# EAGLE design ATR PDB Draft Rev4 (EAGLE 9.6.2)

## Sheet 1 of 3
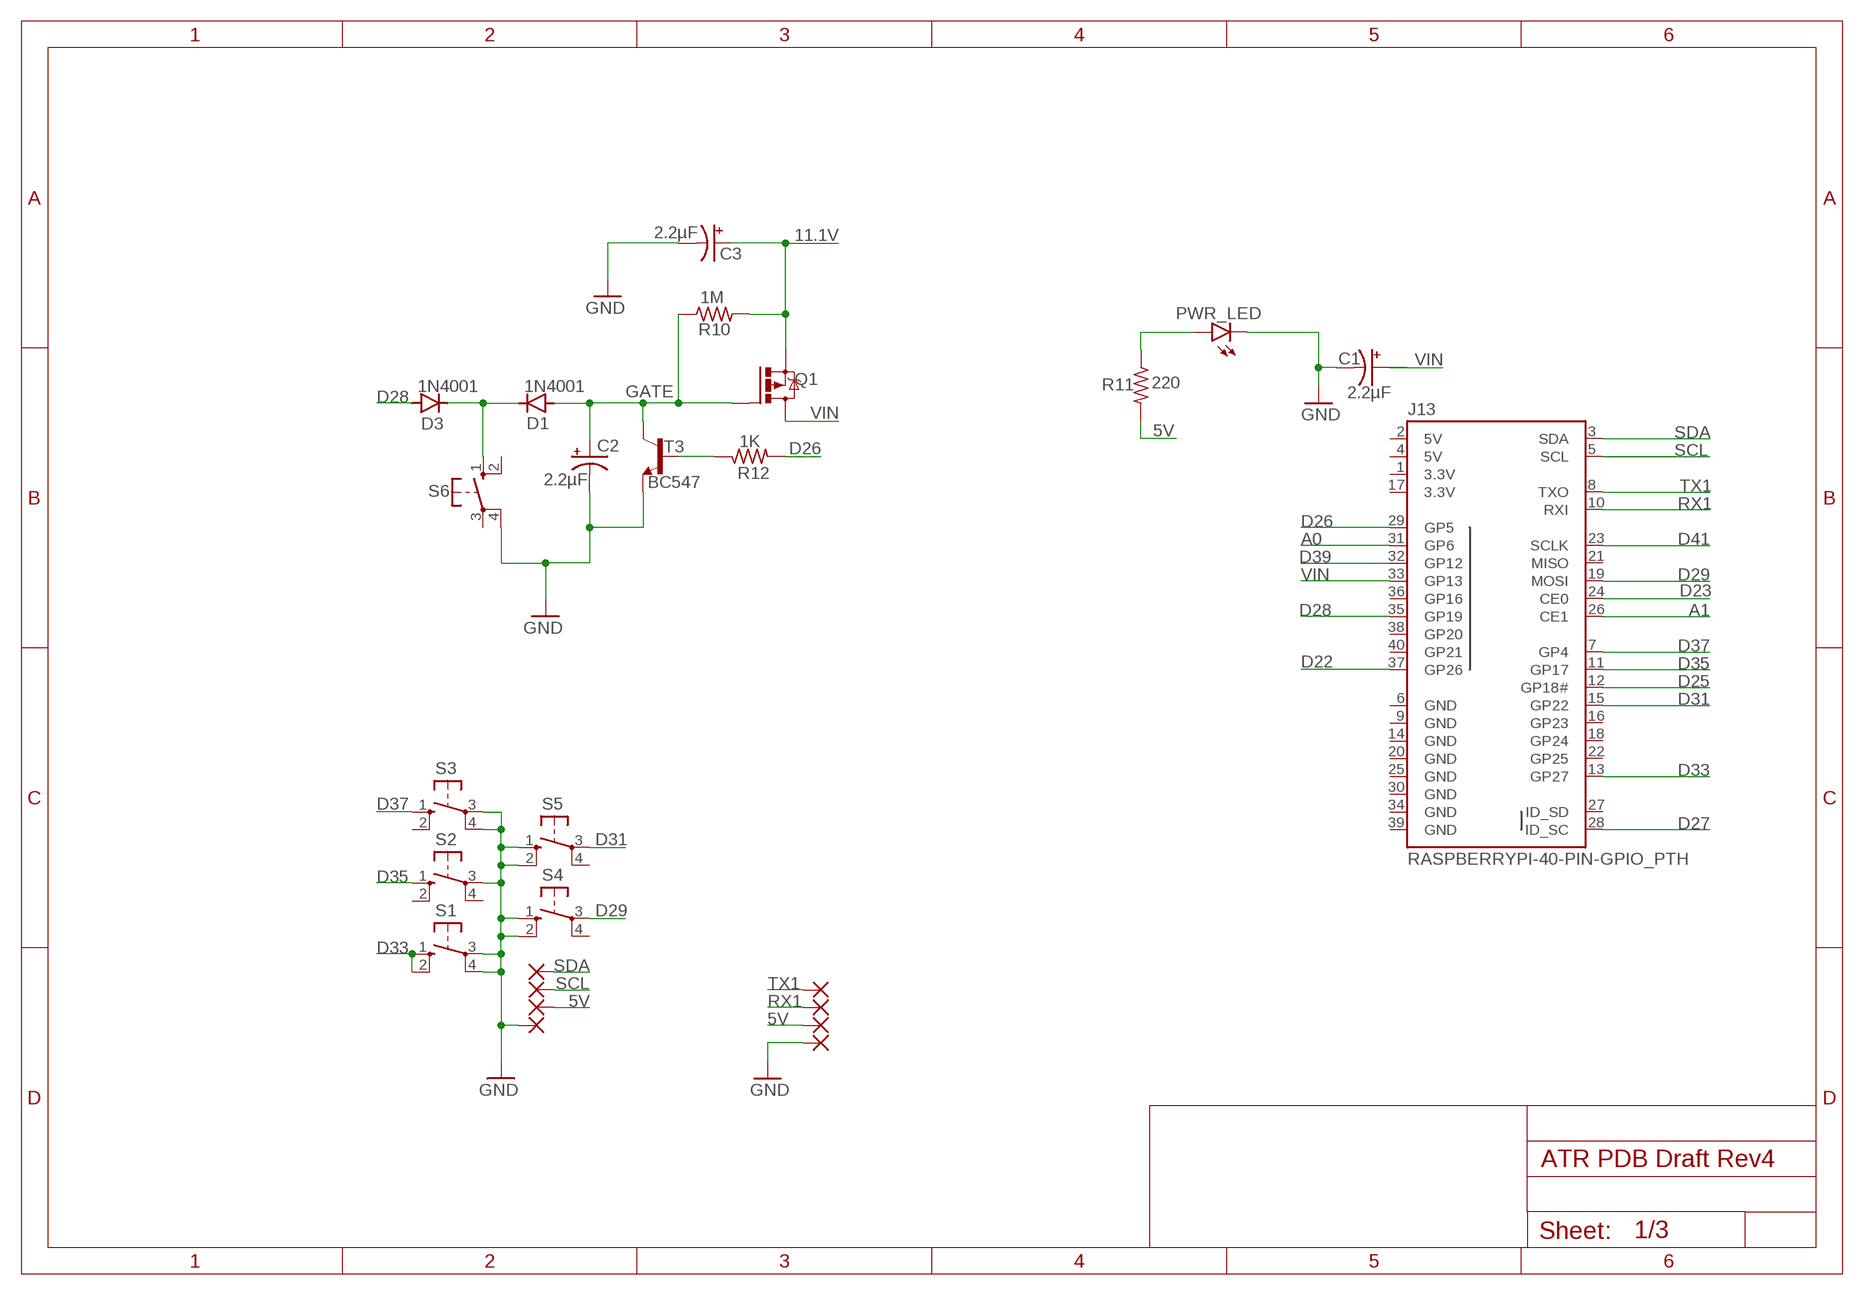
[diagram p0: schematic, sheet 1]

### Parts
C1  2.2µF  CPOL-USTT2D5  [TT2D5]
C2  2.2µF  CPOL-USTT2D5  [TT2D5]
C3  2.2µF  CPOL-USTT2D5  [TT2D5]
D1  1N4004  [DO41-10]
D3  1N4004  [DO41-10]
J13  RASPBERRYPI-40-PIN-GPIO_PTH  [2X20_SHROUDED]
PAD1  1,6/0,8  [1,6/0,8]
PAD2  1,6/0,8  [1,6/0,8]
PAD3  1,6/0,8  [1,6/0,8]
PAD4  1,6/0,8  [1,6/0,8]
PAD5  1,6/0,8  [1,6/0,8]
PAD6  1,6/0,8  [1,6/0,8]
PAD7  1,6/0,8  [1,6/0,8]
PAD8  1,6/0,8  [1,6/0,8]
PWR_LED  LED3MM  [LED3MM]
Q1  IRF9530  [TO220BV]
R10  1M  R-US_0207/10  [0207/10]
R11  220  R-US_0204/7  [0204/7]
R12  1K  R-US_0204/7  [0204/7]
S1  10-XX  [B3F-10XX]
S2  10-XX  [B3F-10XX]
S3  10-XX  [B3F-10XX]
S4  10-XX  [B3F-10XX]
S5  10-XX  [B3F-10XX]
S6  10-XX  [B3F-10XX]
T3  BC547  [TO92]

### Nets
5V: PAD1.1(P) PAD7.1(P) R11.2
11.1V: C3.+ Q1.S R10.2 ; also sheet 2
A0: J13.31(GP6) ; also sheet 2
A1: J13.26(CE1) ; also sheet 3
D22: J13.37(GP26) ; also sheet 2
D23: J13.24(CE0) ; also sheet 3
D25: J13.12(GP18#) ; also sheet 3
D26: J13.29(GP5) R12.2
D27: J13.28(ID_SC) ; also sheet 3
D28: D3.A J13.35(GP19)
D29: J13.19(MOSI) S4.3(P)
D31: J13.15(GP22) S5.3(P)
D33: J13.13(GP27) S1.1(S) S1.2(S1)
D35: J13.11(GP17) S2.1(S)
D37: J13.7(GP4) S3.1(S)
D39: J13.32(GP12) ; also sheet 2
D41: J13.23(SCLK) ; also sheet 2
GATE: C2.+ D1.A Q1.G R10.1 T3.3(C)
GND: C1.- C2.- C3.- PAD3.1(P) PAD8.1(P) PWR_LED.K(C) S1.3(P) S1.4(P1) S2.3(P) S3.3(P) S3.4(P1) S4.1(S) S4.2(S1) S5.1(S) S5.2(S1) S6.4(P1) T3.1(E) ; also sheet 2,3
N$8: PWR_LED.A R11.1
N$11: D1.C D3.C S6.1(S)
RX1: J13.10(RXI) PAD2.1(P)
SCL: J13.5(SCL) PAD6.1(P)
SDA: J13.3(SDA) PAD5.1(P)
T3-B: R12.1 T3.2(B)
TX1: J13.8(TXO) PAD4.1(P)
VIN: C1.+ J13.33(GP13) Q1.D
Unconnected: J13.16(GP23) J13.18(GP24) J13.21(MISO) J13.22(GP25) J13.27(ID_SD) J13.36(GP16) J13.38(GP20) J13.40(GP21) S2.2(S1) S2.4(P1) S3.2(S1) S4.4(P1) S5.4(P1) S6.2(S1) S6.3(P)

### Notes on the sheet
- Arduino Power Switching | Arduino Mega Connections
- OLED Connection & Control
- 3DR Radio Connection
- Aruino Mega Connections

## Sheet 2 of 3
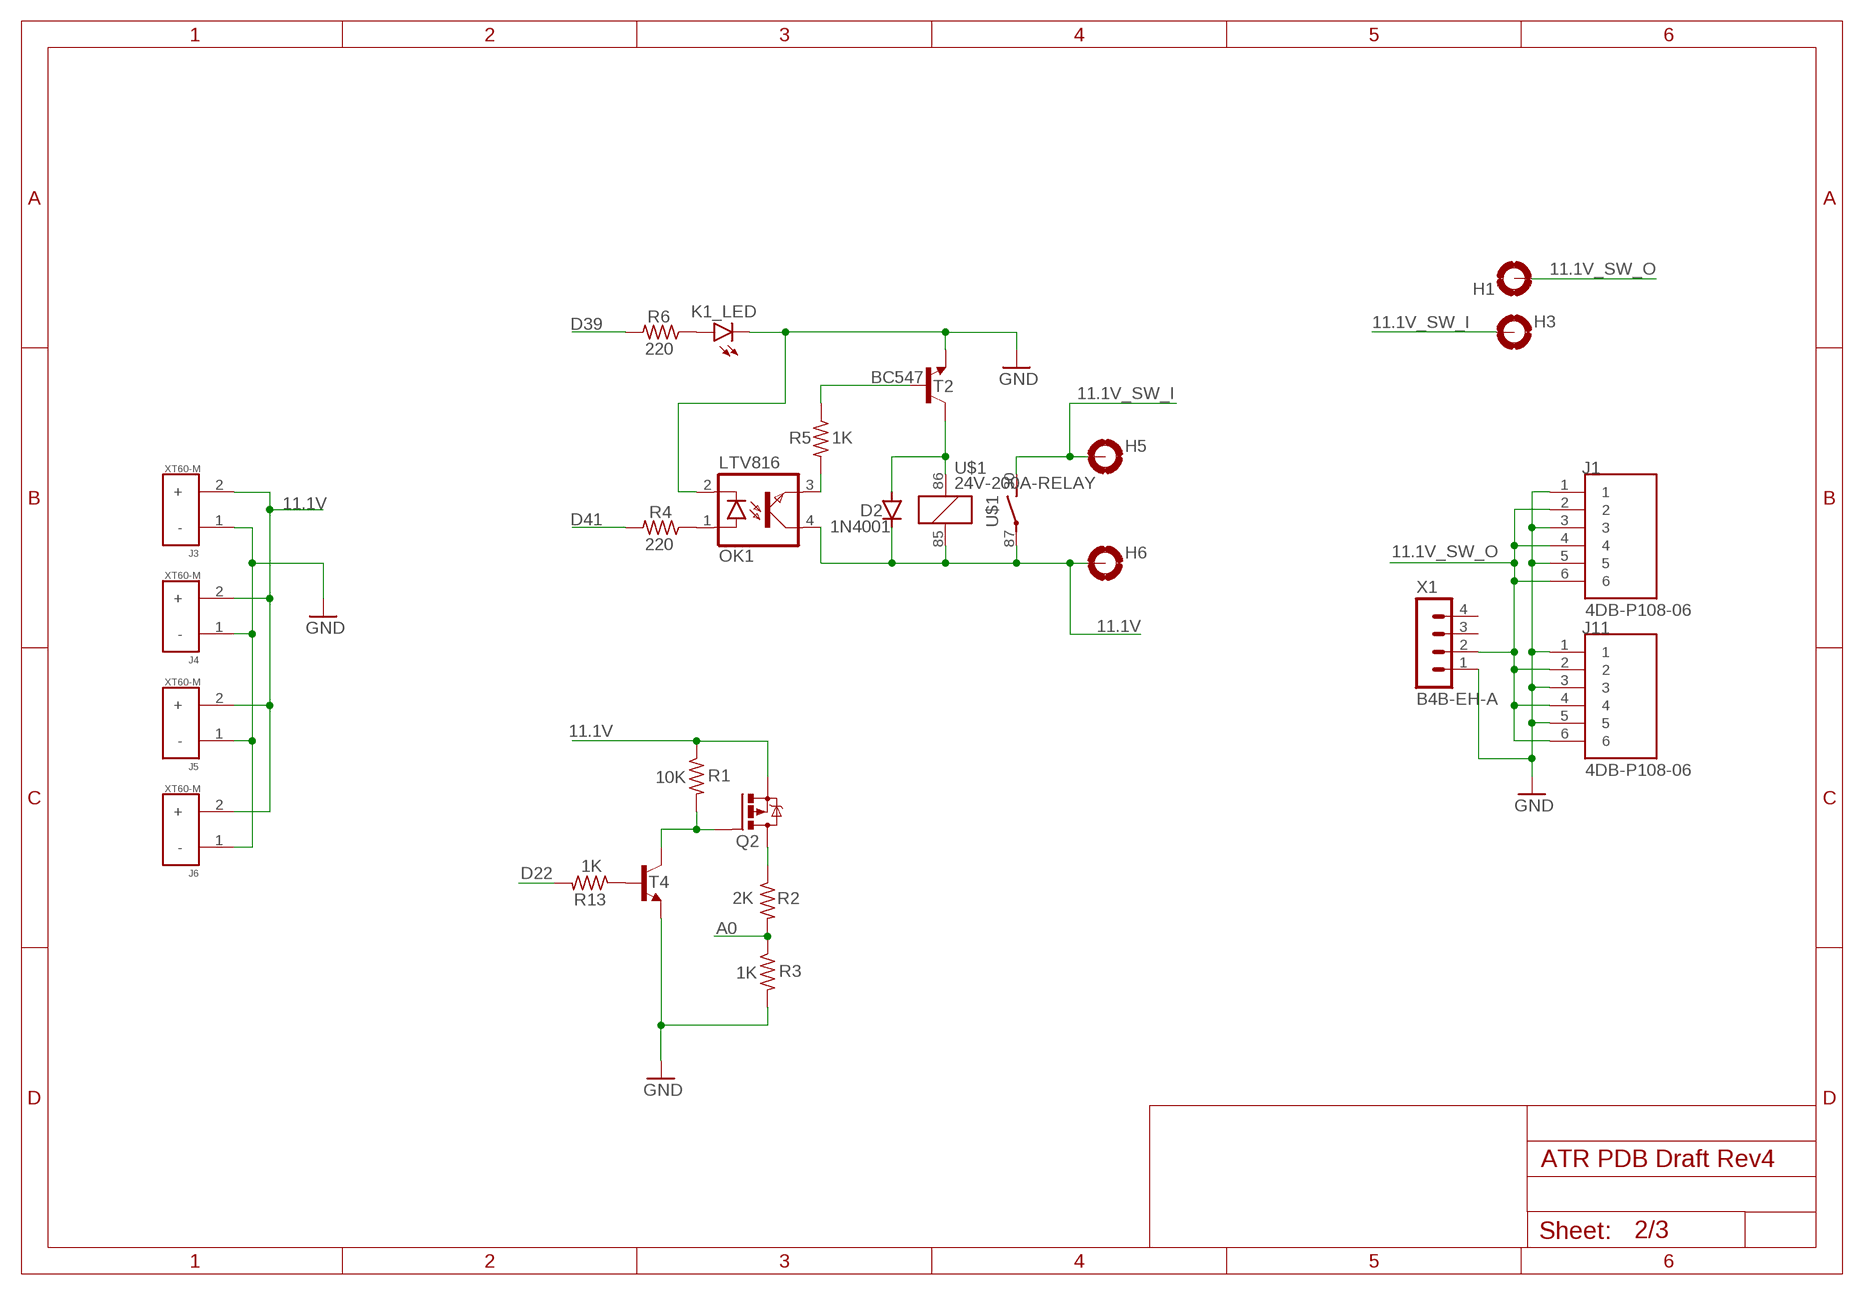
[diagram p1: schematic, sheet 2]

### Parts
D2  1N4004  [DO41-10]
H1  MOUNT-PAD-ROUND3.0  [3,0-PAD]
H3  MOUNT-PAD-ROUND3.0  [3,0-PAD]
H5  MOUNT-PAD-ROUND3.0  [3,0-PAD]
H6  MOUNT-PAD-ROUND3.0  [3,0-PAD]
J1  4DB-P108-06  [TE_2-1437667-9]
J3  XT60-M  [AMASS_XT60-M]
J4  XT60-M  [AMASS_XT60-M]
J5  XT60-M  [AMASS_XT60-M]
J6  XT60-M  [AMASS_XT60-M]
J11  4DB-P108-06  [TE_2-1437667-9]
K1_LED  LED3MM  [LED3MM]
OK1  LTV816  [DIL04]
Q2  IRF9530  [TO220BV]
R1  10K  R-US_0204/7  [0204/7]
R2  2K  R-US_0204/7  [0204/7]
R3  1K  R-US_0204/7  [0204/7]
R4  220  R-US_0204/7  [0204/7]
R5  1K  R-US_0204/7  [0204/7]
R6  220  R-US_0204/7  [0204/7]
R13  1K  R-US_0204/7  [0204/7]
T2  BC547  [TO92]
T4  BC547  [TO92]
U$1  24V-200A-RELAY  [24V-200A-RELAY]
X1  B4B-EH-A  [B4B-EH-A]

### Nets
11.1V: D2.C H6.B3,0(MOUNT) J3.2(+) J4.2(+) J5.2(+) J6.2(+) OK1.4(COL) Q2.S R1.1 U$1.85 U$1.87 ; also sheet 1
11.1V_SW_I: H3.B3,0(MOUNT) H5.B3,0(MOUNT) U$1.30
11.1V_SW_O: H1.B3,0(MOUNT) J1.2 J1.4 J1.6 J11.2 J11.4 J11.6 X1.2
A0: R2.2 R3.1 ; also sheet 1
D22: R13.2 ; also sheet 1
D39: R6.2 ; also sheet 1
D41: R4.2 ; also sheet 1
DRAIN1: Q2.D R2.1
GATE1: Q2.G R1.2 T4.3(C)
GND: J1.1 J1.3 J1.5 J3.1(-) J4.1(-) J5.1(-) J6.1(-) J11.1 J11.3 J11.5 K1_LED.K(C) OK1.2(C) R3.2 T2.1(E) T4.1(E) X1.1 ; also sheet 1,3
N$1: OK1.1(A) R4.1
N$2: K1_LED.A R6.1
N$9: R13.1 T4.2(B)
N$14: OK1.3(EMIT) R5.2
N$15: R5.1 T2.2(B)
N$16: D2.A T2.3(C) U$1.86
Unconnected: X1.3 X1.4

### Notes on the sheet
- 11.1V CUT OFF SWITCH CONNECTION
- 11.1V Relay Control
- 11.1V OUTPUTS
- 11.1V INPUTS
- 11.1V Monitoring
- 11.1V CONNECTIONS,
  MONITORING, AND 
  RELAY CONTROL

## Sheet 3 of 3
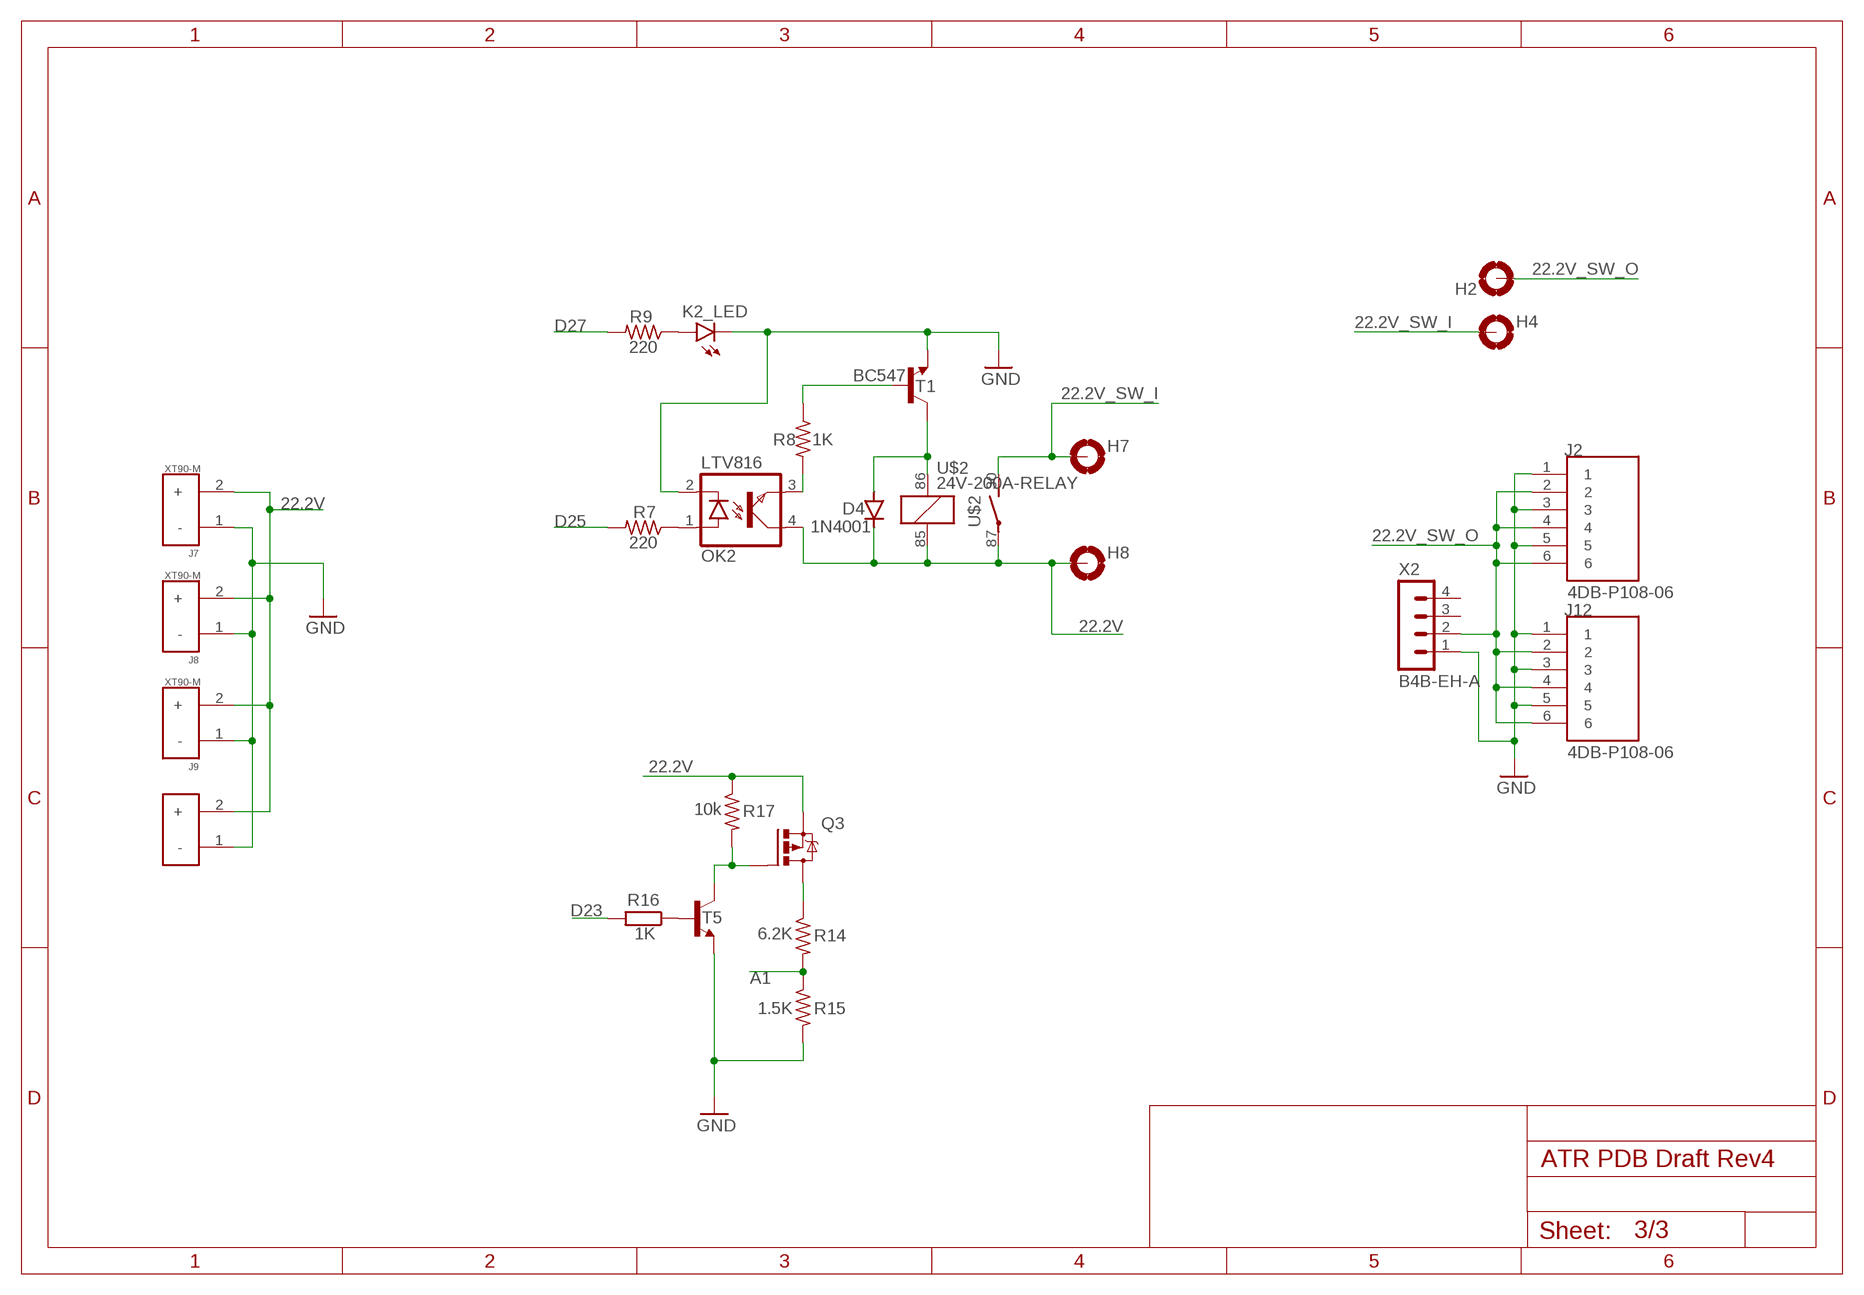
[diagram p2: schematic, sheet 3]

### Parts
D4  1N4004  [DO41-10]
H2  MOUNT-PAD-ROUND3.0  [3,0-PAD]
H4  MOUNT-PAD-ROUND3.0  [3,0-PAD]
H7  MOUNT-PAD-ROUND3.0  [3,0-PAD]
H8  MOUNT-PAD-ROUND3.0  [3,0-PAD]
J2  4DB-P108-06  [TE_2-1437667-9]
J7  XT90-M  [AMASS_XT90-M]
J8  XT90-M  [AMASS_XT90-M]
J9  XT90-M  [AMASS_XT90-M]
J10  XT90-M  [AMASS_XT90-M]
J12  4DB-P108-06  [TE_2-1437667-9]
K2_LED  LED3MM  [LED3MM]
OK2  LTV816  [DIL04]
Q3  IRF9530  [TO220BV]
R7  220  R-US_0204/7  [0204/7]
R8  1K  R-US_0204/7  [0204/7]
R9  220  R-US_0204/7  [0204/7]
R14  6.2K  R-US_0204/7  [0204/7]
R15  1.5K  R-US_0207/10  [0207/10]
R16  1K  R-EU_0204/7  [0204/7]
R17  10k  R-US_0204/7  [0204/7]
T1  BC547  [TO92]
T5  BC547  [TO92]
U$2  24V-200A-RELAY  [24V-200A-RELAY]
X2  B4B-EH-A  [B4B-EH-A]

### Nets
22.2V: D4.C H8.B3,0(MOUNT) J7.2(+) J8.2(+) J9.2(+) J10.2(+) OK2.4(COL) Q3.S R17.1 U$2.85 U$2.87
22.2V_SW_I: H4.B3,0(MOUNT) H7.B3,0(MOUNT) U$2.30
22.2V_SW_O: H2.B3,0(MOUNT) J2.2 J2.4 J2.6 J12.2 J12.4 J12.6 X2.2
A1: R14.2 R15.1 ; also sheet 1
D23: R16.2 ; also sheet 1
D25: R7.2 ; also sheet 1
D27: R9.2 ; also sheet 1
DRAIN2: Q3.D R14.1
GATE2: Q3.G R17.2 T5.3(C)
GND: J2.1 J2.3 J2.5 J7.1(-) J8.1(-) J9.1(-) J10.1(-) J12.1 J12.3 J12.5 K2_LED.K(C) OK2.2(C) R15.2 T1.1(E) T5.1(E) X2.1 ; also sheet 1,2
N$4: OK2.3(EMIT) R8.2
N$5: R8.1 T1.2(B)
N$7: D4.A T1.3(C) U$2.86
N$12: OK2.1(A) R7.1
N$13: K2_LED.A R9.1
N$18: R16.1 T5.2(B)
Unconnected: X2.3 X2.4

### Notes on the sheet
- 22.2V CUT OFF SWITCH CONNECTION
- 22.2V RELAY CONTROL
- 22.2V OUTPUTS
- 22.2V INPUTS
- 22.2V MONITORING
- 22.2V CONNECTIONS,
  MONITORING, AND
  RELAY CONTROL

## Power pins joined to a net without a drawn wire
3.3V: J13.1(3.3V) J13.17(3.3V)
5V: J13.2(5V) J13.4(5V)
GND: J13.6(GND) J13.9(GND) J13.14(GND) J13.20(GND) J13.25(GND) J13.30(GND) J13.34(GND) J13.39(GND)

## Library data of the parts
C1-C3 = rcl:CPOL-US: POLARIZED CAPACITOR, American symbol; SPICEPREFIX: C
D1-D4 = diode:1N4004: DIODE general purpose rectifier, 1 A
H1-H8 = holes:MOUNT-PAD-ROUND: MOUNTING PAD, round
J1 J2 J11 J12 = 4DB-P108-06:4DB-P108-06: Check prices <https://pricing.snapeda.com/parts/4DB-P108-06/TE%20Connectivity/view-part?ref=eda>; AVAILABILITY: Good; COMMENT: 2-1437667-9; DESCRIPTION: 6 Circuit 0.325 (8.26mm) Barrier Block Connector, Screws with Captive Plate; MF: TE Connectivity; MP: 4DB-P108-06; PACKAGE: None; PRICE: None; PURCHASE-URL: https://pricing.snapeda.com/search/part/4DB-P108-06/?ref=eda
J3-J6 = XT60-M:XT60-M: DC supply; XT60; male; PIN:2; for cable; soldered; 60A; 500V; AVAILABILITY: Unavailable; DESCRIPTION: Plug; DC supply; XT60; male; PIN: 2; for cable; soldered; 30A; 500V; MF: AMASS; MP: XT60-M; PACKAGE: Package; PRICE: None
J7-J10 = XT90-M:XT90-M: DC supply; XT60; male; PIN:2; for cable; soldered; 60A; 500V; AVAILABILITY: Unavailable; DESCRIPTION: Plug; DC supply; XT60; male; PIN: 2; for cable; soldered; 30A; 500V; MF: AMASS; MP: XT60-M; PACKAGE: Package; PRICE: None
J13 = SparkFun-Connectors:RASPBERRYPI-40-PIN-GPIO: Raspberry Pi GPIO Header 2x20 pin connector, as found on B, B+, A+ models. Both shrouded PTH and SMT versions available. SparkFun Products: GPIO Shrouded Header <https://www.sparkfun.com/products/13054>- PTH SparkFun Pi Wedge (Preassembled) <https://www.sparkfun.com/products/13717>; PROD_ID: CONN-12263; SF_ID: PRT-13054
K1_LED K2_LED PWR_LED = led:LED: LED OSRAM: - CHIPLED LG R971, LG N971, LY N971, LG Q971, LY Q971, LO R971, LY R971 LH N974, LH R974 LS Q976, LO Q976, LY Q976 LO Q996 - Hyper CHIPLED LW Q18S LB Q993, LB Q99A, LB R99A - SideLED LS A670, LO A670, LY A670, LG A670, LP A670 LB A673, LV A673, LT A673, LW A673 LH A674 LY A675 LS A676, LA A676, LO A676, LY A676, LW A676 LS A679, LY A679, LG A679 - Hyper Micro SIDELED® LS Y876, LA Y876, LO Y876, LY Y876 LT Y87S - SmartLED LW L88C, LW L88S LB L89C, LB L89S, LG L890 LS L89K, LO L89K, LY L89K LS L896, LA L896, LO L896, LY L896 - TOPLED LS T670, LO T670, LY T670, LG T670, LP T670 LSG T670, LSP T670, LSY T670, LOP T670, LYG T670 LG T671, LOG T671, LSG T671 LB T673, LV T673, LT T673, LW T673 LH T674 LS T676, LA T676, LO T676, LY T676, LB T676, LH T676, LSB T676, LW T676 LB T67C, LV T67C, LT T67C, LS T67K, LO T67K, LY T67K, LW E67C LS E67B, LA E67B, LO E67B, LY E67B, LB E67C, LV E67C, LT E67C LW T67C LS T679, LY T679, LG T679 LS T770, LO T770, LY T770, LG T770, LP T770 LB T773, LV T773, LT T773, LW T773 LH T774 LS E675, LA E675, LY E675, LS T675 LS T776, LA T776, LO T776, LY T776, LB T776 LHGB T686 LT T68C, LB T68C - Hyper Mini TOPLED® LB M676 - Mini TOPLED Santana® LG M470 LS M47K, LO M47K, LY M47K Source: http://www.osram.convergy.de LUXEON: - LUMILED® LXK2-PW12-R00, LXK2-PW12-S00, LXK2-PW14-U00, LXK2-PW14-V00 LXK2-PM12-R00, LXK2-PM12-S00, LXK2-PM14-U00 LXK2-PE12-Q00, LXK2-PE12-R00, LXK2-PE12-S00, LXK2-PE14-T00, LXK2-PE14-U00 LXK2-PB12-K00, LXK2-PB12-L00, LXK2-PB12-M00, LXK2-PB14-N00, LXK2-PB14-P00, LXK2-PB14-Q00 LXK2-PR12-L00, LXK2-PR12-M00, LXK2-PR14-Q00, LXK2-PR14-R00 LXK2-PD12-Q00, LXK2-PD12-R00, LXK2-PD12-S00 LXK2-PH12-R00, LXK2-PH12-S00 LXK2-PL12-P00, LXK2-PL12-Q00, LXK2-PL12-R00 Source: www.luxeon.com KINGBRIGHT: KA-3528ASYC Source: www.kingbright.com
OK1 OK2 = optocoupler:LTV816: OPTO COUPLER Source: LITEON, LTV816.pdf; OC_FARNELL: unknown; OC_NEWARK: unknown
PAD1-PAD8 = wirepad:1,6/0,8: THROUGH-HOLE PAD
Q1-Q3 = transistor-power:IRF9530: P-CHANNEL HEXFET POWER-MOS-FET Source: http://www.irf.com/product-info/datasheets/data/irf9530.pdf
R1-R15 R17 = rcl:R-US_: RESISTOR, American symbol; SPICEPREFIX: R
R16 = rcl:R-EU_: RESISTOR, European symbol; SPICEPREFIX: R
S1-S6 = switch-omron:10-XX: OMRON SWITCH; MPN: B3F-1000; OC_FARNELL: 176432; OC_NEWARK: 36M3542
T1-T5 = transistor:BC547: NPN TRANSISTOR
U$1 U$2 = 24V-200A-RELAY:24V-200A-RELAY
X1 X2 = con-JST EH:B4B-EH: JST EH series header 2.50mm pitch disconnectable crimp style connectors, vertical (side entry type), 4 pins

## Board
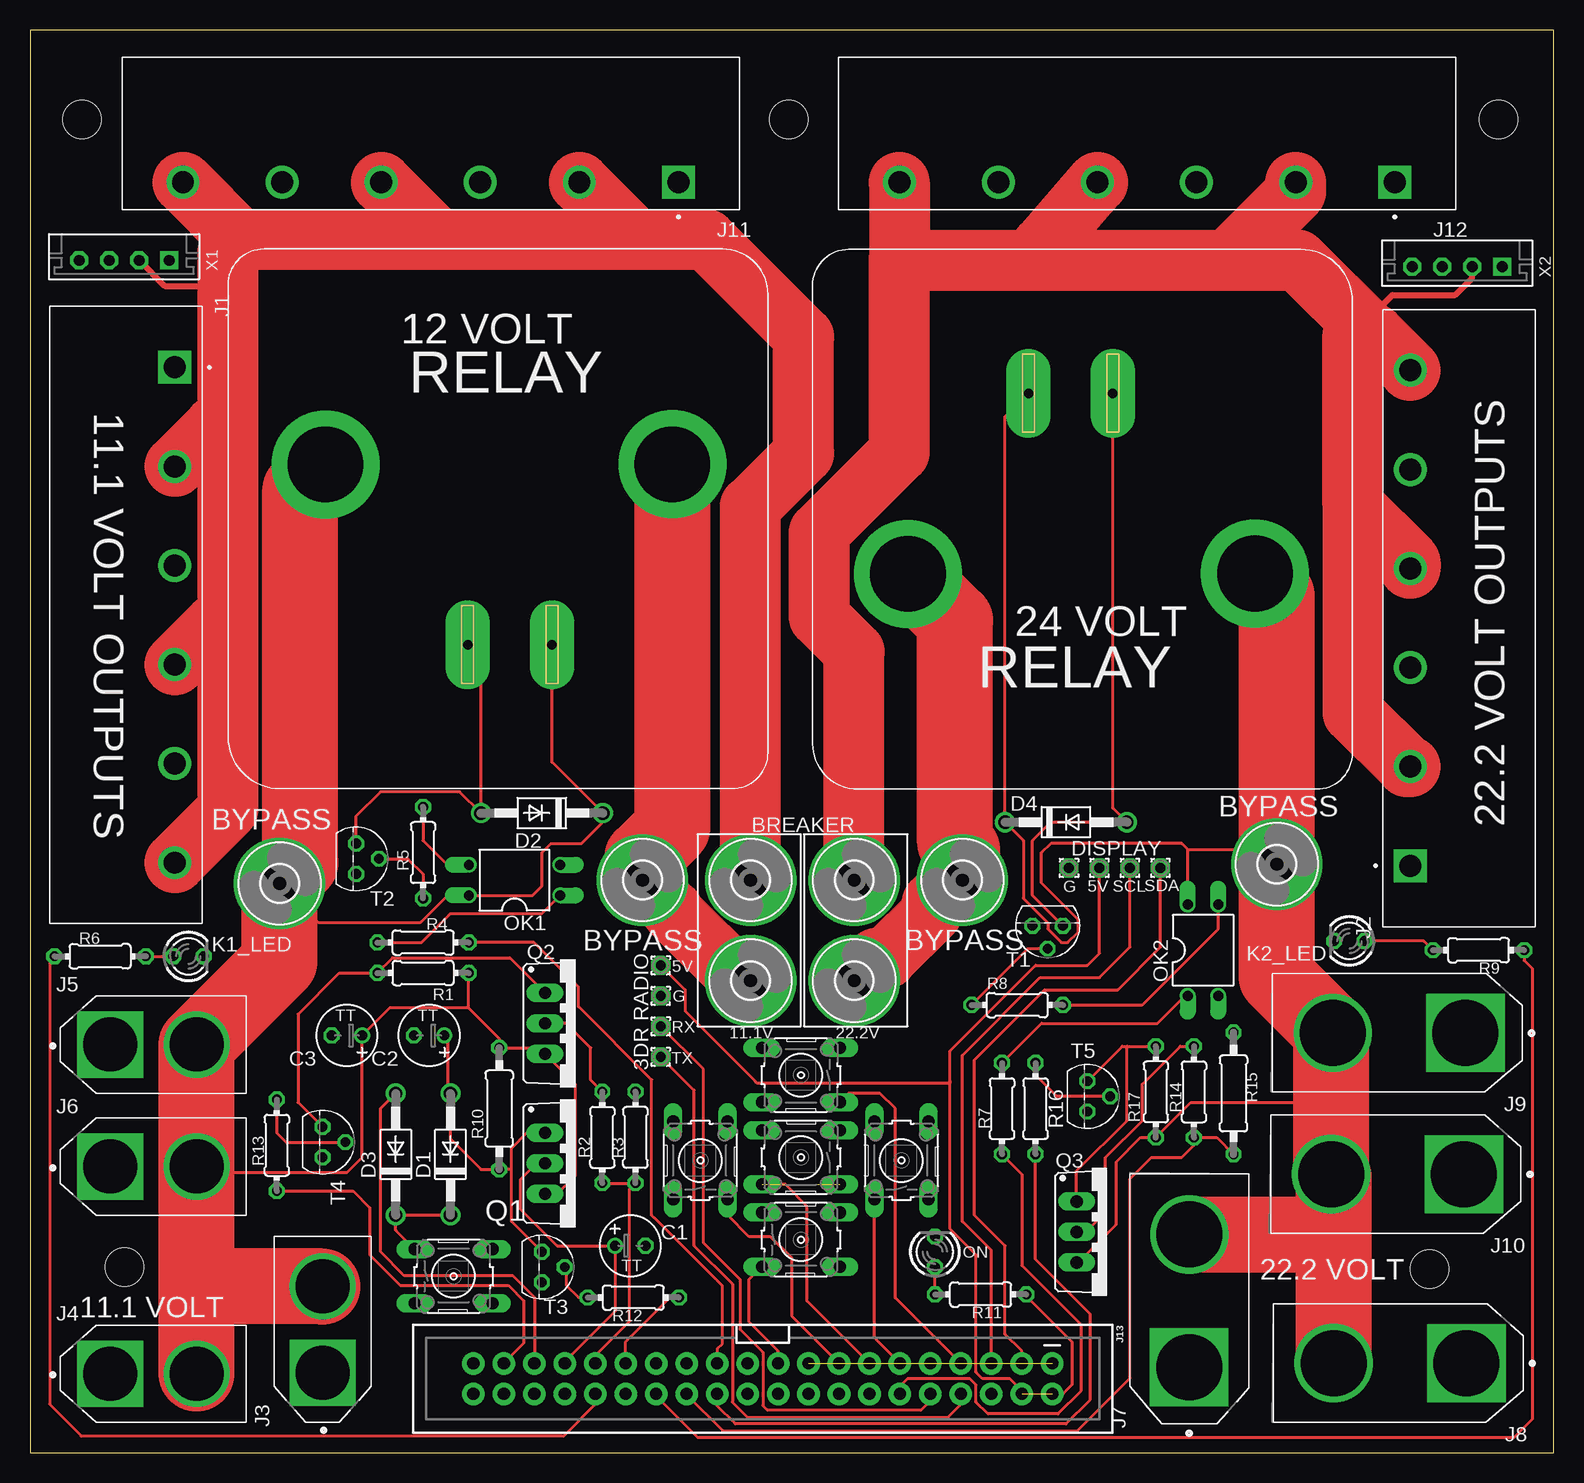
[diagram p3: board, top side]
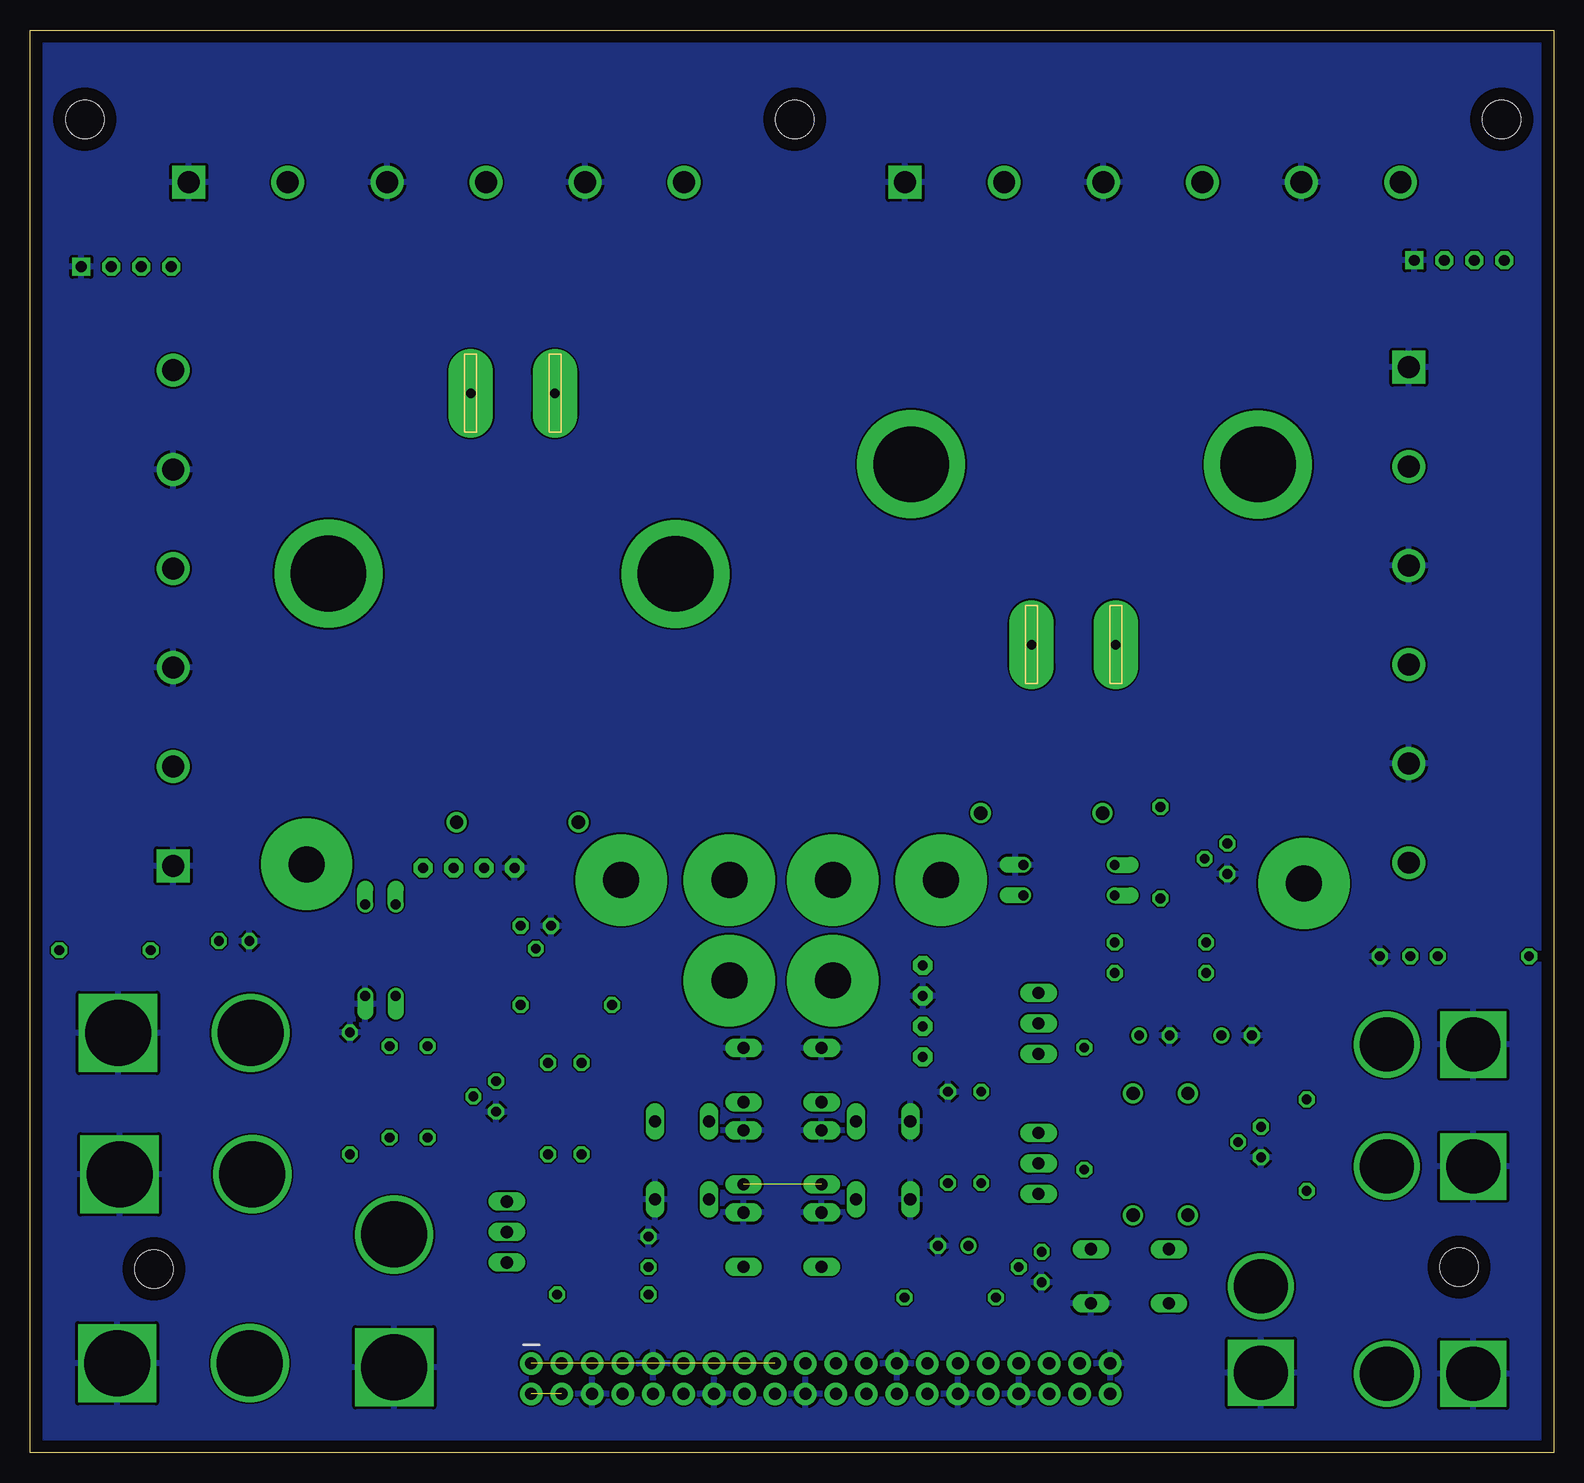
[diagram p4: board, bottom side, seen from below]

Size 127 x 118.62 mm. Coordinates in mm from the lower left corner, seen from the top.
Outline: 0,0 127,0 127,118.62 0,118.62 0,0
Copper layers (1*16): Top 0.035mm / dielectric 1.5mm / Bottom 0.035mm
Design rules "default": minimum track width 6mil, minimum drill 0.35mm, track to track 6mil, track to pad 6mil, pad to pad 6mil, via to via 6mil, smd to smd 6mil, copper to edge 40mil, drill to drill 6mil, minimum pad ring 10mil, minimum via ring 8mil, stop-mask expansion 4mil, vias tented up to drill 0mil, thermal gap 10mil
Holes 3.2 mm at 7.87,15.49 116.66,15.34 63.25,111.18 4.32,111.18 122.43,111.18

### Footprints (pad centres in the part's own frame; a part is rotated, then mirrored left to right if it is on the bottom)
TT2D5 = drill 0.813: + -1.27,0 | drill 0.813 octagon: - 1.27,0
DO41-10 = drill 1.118: A 5.08,0; C -5.08,0
3,0-PAD = drill 3 pad 7.62: B3,0 0,0
TE_2-1437667-9 = drill 1.83 square: 1 -20.65,0 | drill 1.83: 2 -12.39,0; 3 -4.13,0; 4 4.13,0; 5 12.39,0; 6 20.65,0
AMASS_XT60-M = drill 4.5 square: 1 -3.6,0 | drill 4.5: 2 3.6,0
AMASS_XT90-M = drill 5.5 square: 1 -3.029,0.905 | drill 5.5: 2 8.045,0.889
2X20_SHROUDED = drill 1.016 pad 1.88: 1 -1.27,24.13; 2 1.27,24.13; 3 -1.27,21.59; 4 1.27,21.59; 5 -1.27,19.05; 6 1.27,19.05; 7 -1.27,16.51; 8 1.27,16.51; 9 -1.27,13.97; 10 1.27,13.97; 11 -1.27,11.43; 12 1.27,11.43; 13 -1.27,8.89; 14 1.27,8.89; 15 -1.27,6.35; 16 1.27,6.35; 17 -1.27,3.81; 18 1.27,3.81; 19 -1.27,1.27; 20 1.27,1.27; 21 -1.27,-1.27; 22 1.27,-1.27; 23 -1.27,-3.81; 24 1.27,-3.81; 25 -1.27,-6.35; 26 1.27,-6.35; 27 -1.27,-8.89; 28 1.27,-8.89; 29 -1.27,-11.43; 30 1.27,-11.43; 31 -1.27,-13.97; 32 1.27,-13.97; 33 -1.27,-16.51; 34 1.27,-16.51; 35 -1.27,-19.05; 36 1.27,-19.05; 37 -1.27,-21.59; 38 1.27,-21.59; 39 -1.27,-24.13; 40 1.27,-24.13
LED3MM = drill 0.813 octagon: A -1.27,0; K 1.27,0
DIL04 = drill 0.813 offset: 1 -1.27,-3.81; 2 1.27,-3.81; 3 1.27,3.81; 4 -1.27,3.81
1,6/0,8 = drill 0.813 pad 1.6 octagon: 1 0,0
TO220BV = drill 1.016 long: D 0,-2.54; G -2.54,-2.54; S 2.54,-2.54
0204/7 = drill 0.813 octagon: 1 -3.81,0; 2 3.81,0
0207/10 = drill 0.813 octagon: 1 -5.08,0; 2 5.08,0
B3F-10XX = drill 1.016 long: 1 -3.251,2.261; 2 3.251,2.261; 3 -3.251,-2.261; 4 3.251,-2.261
TO92 = drill 0.813 octagon: 1 1.27,0; 2 0,1.905; 3 -1.27,0
24V-200A-RELAY = drill 6.3 pad 9: 30 37.045,27.054; 87 8.127,27.021 | drill 0.8 pad 3.7 long: 85 26.999,12.004; 86 19.975,12.003
B4B-EH-A = drill 0.9 pad 1.5 square: 1 -3.75,0 | drill 0.9 pad 1.5 octagon: 2 -1.25,0; 3 1.25,0; 4 3.75,0

### Placement (x,y rotation side)
C1  50.04,17.27 0 top
C2  33.27,34.8 180 top
C3  26.42,34.8 180 top
D1  35.05,24.89 90 top
D2  42.67,53.34 180 top
D3  30.48,24.89 90 top
D4  86.36,52.58 0 top
H1  60.07,47.75 0 top
H2  68.71,47.75 0 top
H3  60.07,39.37 0 top
H4  68.71,39.37 0 top
H5  51.05,47.75 180 top
H6  20.8,47.47 180 top
H7  77.72,47.75 0 top
H8  103.94,49.07 0 top
J1  12.06,69.85 270 top
J2  115.06,69.6 90 top
J3  24.38,10.29 90 top
J4  10.29,6.6 0 top
J5  10.29,34.04 0 top
J6  10.29,23.88 0 top
J7  97.54,10.16 90 top
J8  116.71,8.38 180 top
J9  116.64,35.92 180 top
J10  116.51,24.13 180 top
J11  33.4,105.92 180 top
J12  93.12,105.92 180 top
J13  61.09,6.2 270 top
K1_LED  13.21,41.4 0 top
K2_LED  109.98,42.67 180 top
OK1  40.39,47.75 90 top
OK2  97.79,41.91 0 top
PAD1  52.58,40.64 270 top
PAD2  52.58,35.56 270 top
PAD3  52.58,38.1 270 top
PAD4  52.58,33.02 270 top
PAD5  94.23,48.77 0 top
PAD6  91.69,48.77 0 top
PAD7  89.15,48.77 0 top
PAD8  86.61,48.77 0 top
PWR_LED  75.44,16.76 90 top
Q1  45.47,24.13 270 top
Q2  45.47,35.81 270 top
Q3  89.79,18.41 270 top
R1  32.77,40.01 180 top
R2  47.71,26.3 270 top
R3  50.47,26.3 90 top
R4  32.77,42.55 0 top
R5  32.77,50.04 90 top
R6  5.84,41.4 180 top
R7  81.03,28.7 270 top
R8  82.3,37.34 0 top
R9  120.75,41.91 0 top
R10  39.12,28.7 90 top
R11  79.25,13.21 0 top
R12  50.29,12.95 0 top
R13  20.57,25.65 270 top
R14  97.03,30.1 270 top
R15  100.33,29.97 90 top
R16  83.82,28.7 270 top
R17  93.85,30.1 90 top
S1  64.26,24.64 180 top
S2  72.64,24.38 90 top
S3  64.26,31.5 180 top
S4  64.26,17.78 0 top
S5  55.88,24.38 90 top
S6  35.31,14.73 0 top
T1  84.84,43.94 180 top
T2  27.18,49.53 270 top
T3  42.67,15.49 270 top
T4  24.38,25.91 270 top
T5  88.14,29.72 270 top
U$1  16.51,55.37 0 top
U$2  110.24,100.33 180 top
X1  7.85,99.42 180 top
X2  118.97,98.88 180 top

### Tracks (layer width: path | path; a pad name or v marks a point on that pad's centre or on a via)
3.3V  (1 unrouted)
5V  (1 unrouted)
  Top 0.254: J13.2 86.11,4.93 86.87,5.69 86.87,9.25 83.06,13.06 R11.2 | J13.4 82.68,5.21 81.69,6.2 79.4,6.2 78.87,6.73 78.87,16.51 76.71,18.67 76.71,30.86 | PAD1.1 54.61,38.61 54.61,36.83 60.42,31.02 60.58,30.86 76.71,30.86 | 76.71,30.86 76.71,30.99 | PAD7.1 89.15,41.66 88.14,40.64 83.82,40.64 76.71,33.53 76.71,30.86
11.1V
  Top 0.254: H6.B3,0 24.08,44.2 32.51,44.2 34.8,46.48 OK1.4 41.91,46.48 42.67,47.24 42.67,50.04 43.43,50.8 45.97,50.8 47.75,52.58 D2.C 43.51,57.58 U$1.85 | Q1.S 43.94,21.59 45.47,23.11 45.47,30.73 Q2.S 42.42,33.78 R10.2 39.12,34.54 36.58,37.08 | 36.58,37.08 R1.1 | 36.58,37.08 29.97,37.08 C3.+ 27.69,24.64 26.42,23.37 13.89,23.37 13.89,23.62 J6.2
  Top 6.35: J6.2 J5.2 20.8,40.95 H6.B3,0 22.53,49.2 22.53,80.29 U$1.87 | J4.2 13.89,13.89 | 13.89,13.89 13.89,23.62 | J3.2 13.89,13.89
11.1V_SW_I
  Top 5.08: H5.B3,0 53.57,45.24 53.57,45.06 59.26,39.37 H3.B3,0
  Top 6.35: H5.B3,0 51.05,49.61 53.55,52.11 U$1.30
11.1V_SW_O
  Top 0.508: X1.2 11.23,97.28 16.51,97.28
  Top 5.08: 50.57,101.14 56.39,101.14 64.49,93.04 64.49,83.33 60.06,78.89 60.06,47.77 H1.B3,0 | 50.57,101.14 34.05,101.14 | 34.05,101.14 17.53,101.14 | J11.6 17.53,101.14 | J11.4 34.05,101.14 | J11.2 50.57,101.14 | J1.6 16.51,53.65 16.51,69.09 | 17.53,101.14 16.51,100.13 16.51,97.28 16.51,85.6 | 16.51,69.09 16.51,85.6 | J1.2 15.42,85.6 16.51,85.6 | J1.4 15.43,69.09 16.51,69.09
22.2V
  Top 0.254: OK2.4 96.52,50.29 | Q3.S 87.38,15.88 90.55,19.05 90.55,24.26 92.58,26.29 R17.1 96.77,29.21 108.03,29.21 108.47,28.78 | 96.52,50.29 102.72,50.29 H8.B3,0 | 96.52,50.29 96.01,50.8 85.09,50.8 84.33,50.04 84.33,47.5 87.38,44.45 87.38,43.43 86.49,42.55 85.98,42.55 84.84,43.69 84.84,44.2 82.8,46.23 82.8,51.05 D4.C 81.28,86.37 U$2.85
  Top 6.35: J8.2 108.67,17.53 | 108.67,17.53 108.67,23.04 J10.2 108.47,28.78 108.47,34.9 J9.2 103.94,39.68 H8.B3,0 103.94,71.48 U$2.87 | J7.2 107.99,18.2 108.67,17.53
22.2V_SW_I
  Top 5.08: H7.B3,0 77.09,47.75 75.21,45.87 75.21,45.06 71.4,41.25 70.59,41.25 H4.B3,0
  Top 6.35: H7.B3,0 77.72,50.24 77.11,50.85 77.11,69.35 U$2.30
22.2V_SW_O
  Top 0.508: 110.29,93.24 113.56,96.52 118.8,96.52 120.22,97.95 X2.2
  Top 5.08: H2.B3,0 68.71,66.8 65.81,69.7 65.81,76.76 72.47,83.41 72.47,99.52 | J12.6 72.47,99.52 | 72.47,99.52 72.54,99.44 84.35,99.44 | 110.29,79.02 110.29,93.24 111.84,93.24 | 110.29,79.02 110.29,61.72 114.8,57.21 J2.2 | 84.35,99.44 99.85,99.44 | 99.85,99.44 105.64,99.44 111.84,93.24 | 110.29,79.02 115.06,74.24 J2.4 | 111.84,93.24 112.06,93.24 J2.6 | 84.35,99.44 84.35,100.57 J12.4 | 99.85,99.44 105.51,105.1 J12.2
A0
  Top 0.254: J13.31 47.12,8.1 49.99,10.97 49.99,22.01 50.44,22.46 | 50.44,22.46 R3.1 | R2.2 50.41,22.49 50.44,22.46
A1
  Top 0.254: J13.26 54.74,4.85 57.76,1.83 87.3,1.83 91.69,6.22 91.69,22.86 93.47,24.64 96.01,24.64 97.03,25.65 R14.2 98.93,26.29 R15.1
D22
  Top 0.254: R13.2 26.92,21.84 28.32,20.45 28.32,16.51 30.86,13.97 39.88,13.97 41.15,12.7 41.15,9.14 39.5,7.49 J13.37
D23
  Top 0.254: R16.2 83.82,16.13 88.39,11.56 88.39,4.45 86.36,2.41 58.8,2.41 57.28,3.94 J13.24
D25
  Top 0.254: J13.12 72.52,5.56 73.15,6.2 78.33,6.2 78.87,5.66 78.87,4.24 79.86,3.25 85.7,3.25 87.63,5.18 87.63,10.67 82.68,15.62 82.68,23.24 R7.2
D26
  Top 0.254: J13.29 49.66,9.27 50.8,10.41 51.05,10.67 53.34,12.95 R12.2
D27
  Top 0.254: R9.2 124.56,41.05 125.24,40.37 125.24,2.81 123.7,1.27 55.68,1.27 52.2,4.75 J13.28
D28
  Top 0.254: J13.35 42.06,7.49 42.06,12.98 40.26,14.78 31.19,14.78 29.21,16.76 29.21,28.7 D3.A
D29
  Top 0.254: J13.19 62.36,8.51 59.94,10.92 59.94,14.48 60.98,15.52 S4.3
D31
  Top 0.254: J13.15 63.5,11.4 63.5,16.26 61.72,18.03 59.94,18.03 58.14,19.84 S5.3
D33  (1 unrouted)
  Top 0.254: J13.13 64.77,12.68 64.77,20.57 62.97,22.38 S1.2
D35
  Top 0.254: S2.1 70.38,18.26 70.38,9.6 J13.11
D37
  Top 0.254: J13.7 72.14,12.93 72.14,28.7 70.87,29.97 68.25,29.97 S3.1
D39
  Top 0.254: R6.2 1.63,41 1.63,4.06 4.27,1.42 44.5,1.42 47.12,4.04 J13.32
D41
  Top 0.254: J13.23 57.28,8.66 57.71,9.09 57.71,13.95 52.09,19.56 52.07,19.56 51.82,19.81 51.82,31.11 45.72,37.21 45.72,38.86 42.04,42.55 R4.2
DRAIN1
  Top 0.254: R2.1 46.74,31.09 46.74,33.78 44.7,35.81 Q2.D
DRAIN2
  Top 0.254: R14.1 95.89,33.91 92.71,30.73 92.71,27.68 89.66,24.63 89.66,20.07 88.01,18.41 Q3.D
GATE
  Top 0.254: T3.3 40.13,19.3 40.13,23.62 | C2.+ 34.8,34.54 34.8,30.23 D1.A 35.05,26.16 37.59,23.62 R10.1 40.13,23.62 | 40.13,23.62 40.13,25.4 41.4,26.67 Q1.G
GATE1
  Top 0.254: Q2.G 40.01,41.27 30.23,41.27 R1.2 25.78,40.01 22.35,36.58 22.35,29.21 T4.3
GATE2
  Top 0.254: T5.3 91.06,33.91 91.44,33.91 | 91.44,33.91 R17.2 | 91.44,33.91 91.44,27.69 87.25,23.5 Q3.G
GND
  pour Bottom: 0,118.62 127,118.62 127,0 0,0
N$1
  Top 0.254: R4.1 32.64,42.55 35.05,44.96 42.67,44.96 OK1.1
N$2
  Top 0.254: R6.1 K1_LED.A
N$4
  Top 0.254: R8.2 92.71,37.34 99.06,43.69 OK2.3
N$5
  Top 0.254: R8.1 83.19,42.04 T1.2
N$7
  Top 0.254: T1.3 83.57,46.48 83.57,51.05 85.09,52.58 D4.A 90.26,53.76 U$2.86
N$8
  Top 0.254: R11.1 PWR_LED.A
N$9
  Top 0.254: R13.1 20.57,26.67 21.34,25.91 T4.2
N$11
  Top 0.254: S6.1 30.48,18.57 D3.C D1.C
N$12
  Top 0.254: OK2.1 96.27,38.1 93.98,35.81 84.33,35.81 R7.1
N$13
  Top 0.254: R9.1 116.18,42.67 K2_LED.A
N$14
  Top 0.254: R5.2 32.77,51.05 34.8,49.02 OK1.3
N$15
  Top 0.254: T2.2 31.5,49.53 32.77,48.26 R5.1
N$16
  Top 0.254: T2.3 27.18,53.09 29.21,55.12 35.81,55.12 D2.A 37.59,66.27 U$1.86
N$18
  Top 0.254: T5.2 85.6,29.72 83.82,31.5 R16.1
RX1
  Top 0.254: J13.10 75.06,4.34 74.3,3.58 61.44,3.58 61.09,3.94 61.09,8.41 59.18,10.31 59.18,14.48 56.13,17.53 56.13,32 PAD2.1
SCL
  Top 0.254: J13.5 80.14,16.89 77.72,19.3 77.72,33.15 84.2,39.62 89.15,39.62 91.69,42.16 PAD6.1
SDA
  Top 0.254: J13.3 82.68,8.51 81.28,9.91 81.28,17.27 78.74,19.81 78.74,32.77 84.58,38.61 90.68,38.61 94.23,42.16 PAD5.1
T3-B
  Top 0.254: T3.2 44.7,15.37 44.7,13.97 45.72,12.95 R12.1
TX1
  Top 0.254: J13.8 77.6,4.04 76.53,2.97 59.82,2.97 58.55,4.24 58.55,14.1 55.37,17.27 55.37,30.23 PAD4.1
VIN
  Top 0.254: J13.33 44.58,7.59 48.77,11.79 C1.+ 43.94,17.27 40.87,20.34 40.87,22.78 42.22,24.13 Q1.D

### Text on the board
tPlace: G | 5V | SCL | SDA | 5V | G | RX | TX | ON
tNames: 12 VOLT | 11.1 VOLT OUTPUTS | 24 VOLT | BYPASS | BYPASS | BREAKER | 22.2 VOLT OUTPUTS | DISPLAY | BYPASS | 3DR RADIO | BYPASS | 11.1V | 22.2V | 22.2 VOLT | 11.1 VOLT